# Altium schematic sheet Jetson_PCB.SchDoc
size A
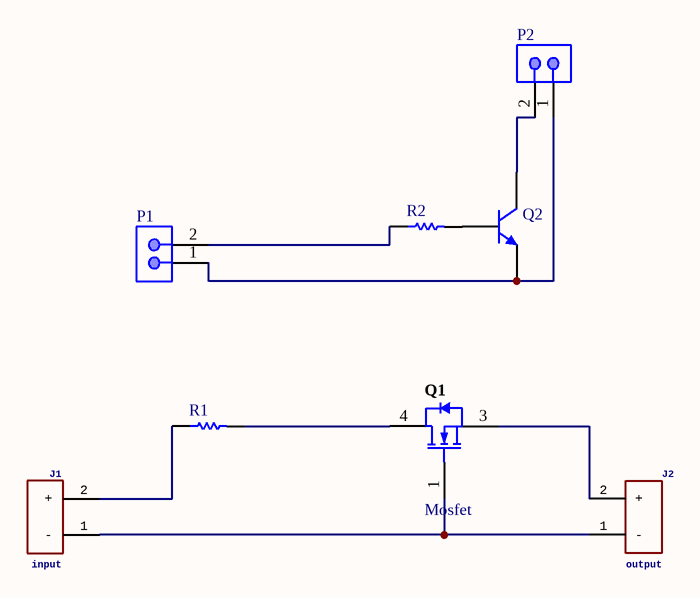
[diagram p0: Jetson_PCB.SchDoc]

## Parts
J1  input  [AMASS_XT60-M]
J2  output  [AMASS_XT60-M]
P1  B2B-EH-A  [JST-B2B-EH-A_V]  (value not drawn)
P2  B2B-EH-A  [JST-B2B-EH-A_V]  (value not drawn)
Q1  Mosfet  [FAIR-TO-252-3_V]
Q2  2N3904  [TO-92A]  (value not drawn)
R1  RR1220P-561-D  [RESC2013X50X40ML20T20]  (value not drawn)
R2  RR1220P-561-D  [RESC2013X50X40ML20T20]  (value not drawn)

## Nets
NetJ1_1: J1.1(-) J2.1(-) Q1.1(G)
NetJ1_2: J1.2(+) R1.1
NetJ2_2: J2.2(+) Q1.3(S)
NetP1_1: P1.1 P2.1 Q2.1(E)
NetP1_2: P1.2 R2.1
NetP2_2: P2.2 Q2.3(C)
NetQ1_4: Q1.4(D) R1.2
NetQ2_2: Q2.2(B) R2.2

## Library data of the parts
J1 J2 = XT60-M: GateName_1: G$1; MF: AMASS; SymbolName_1: XT60-M; LibraryName: XT60-M; DeviceSetName: XT60-M; Package: AMASS_XT60-M; AVAILABILITY: Unavailable; MP: XT60-M; PACKAGE: Package Analog Devices; PRICE: None
P1 P2 = CMP-2000-05887-1: Male Header, Pitch 2.5 mm, 1 x 2 Position, Height 6 mm, Tail Length 3.2 mm, -25 to 85 degC, RoHS, Bulk; Manufacturer: JST; Other Names: 455-1014; Mating Products: 455-1000-ND-CONNHOUSINGEH2POS2.5MMCRIMP455-2933-ND-CONNRECEPTHR2POS2.5MMBLACK455-2934-ND-CONNRECEPTHR2POS2.5MMWHITE455-1044-ND-CONNRECEPTHR2POS2.5MMWHITE455-1057-ND-CONNRECEPTHR2POS2.5MMBLACK; Pitch: 0.098"(2.50mm); Connector Type: Header,Shrouded; Number of Positions: 2; Number of Positions Loaded: All; Manufacturer URL: http://www.jst.com/home2.html; Contact Type: MalePin; Package Description: Male Header, Pitch 2.5 mm, 1 x 2 Position, Height 6 mm, Tail Length 3.2 mm; Mounting Type: ThroughHole; Mounting Technology: ThroughHole; Number of Rows: 1; Features: -; Fastening Type: DetentLock; Contact Finish Thickness: -; Datasheet Version: 10/2002; Termination: Press-Fit; Datasheet URL: http://media.digikey.com/pdf/Data%20Sheets/JST%20PDFs/EH%20Series.pdf; Standard Package: 1,000; Category: Connectors,Interconnects; Family: RectangularConnectors-Headers,MalePins; Contact Finish: Tin-Lead; Packaging: Bulk; Color: Natural; Package Reference: B2B-EH-A; Row Spacing: -; Contact Mating Length: 0.130"(3.30mm); Series: EH
Q1 = CMP-2000-06284-1: N-Channel QFET(R) MOSFET, 600 V, 1.9 A, 4.7 Ohm, -55 to 150 degC, 3-Pin DPAK (TO-252), RoHS, Tape and Reel; Manufacturer: FairchildSemiconductor; Rad Hard: No; Package Version: Rev. 11, 05/2016; Typical Turn-Off Delay Time: 24ns; Channel Mode: Enhancement; Typical Fall Time: 28ns; Maximum Continuous Drain Current: 1.9A; Channel Type: N; Typical Turn-On Delay Time: 9ns; Typical Rise Time: 25ns; RDS-on: 4700@10VmOhm; Maximum Drain Source Voltage: 600V; Maximum Gate Source Voltage: ±30V; Category: MOSFET; Package Reference: TO-252; Datasheet URL: https://www.fairchildsemi.com/datasheets/FQ/FQD2N60C.pdf; Operating Temperature: -55to150°C; Package: 3DPAK; Mounting: SurfaceMount; Packaging: Tape&Reel; Package Description: 3-Pin Transistor Outline, Body 6.54 x 6.095 mm, Pitch 2.28 mm; Manufacturer URL: https://www.fairchildsemi.com/; Package URL: https://www.fairchildsemi.com/package-drawings/TO/TO252A03.pdf; Mounting Technology: SurfaceMount; Datasheet Version: Rev. 1.4, 11/2015
Q2 = 2N3904: NPN General Purpose Amplifier; Published: 8-Jun-2000; LatestRevisionDate: 15-Jan-2003; LatestRevisionNote: PCB Footprint 'BCY-W3/D4.7' replaced; DatasheetVersion: 1997; PackageVersion: Sep-1998; PackageReference: TO-92A; Publisher: Altium Limited; PackageDescription: TO, Flat Index; 3 In-Line, Axial Leads; Body Dia. 4.5mm; Leads 0.51 x 0.48 mm (max); ComponentLink1Description: Manufacturer Link; ComponentLink1URL: http://www.fairchildsemi.com/; ComponentLink2Description: Datasheet; ComponentLink2URL: http://www.fairchildsemi.com/ds/2N%2F2N3904.pdf
R1 R2 = CMP-2001-03458-1: Manufacturer: Susumu; Part Number: RR1220P-561-D